# Altium schematic sheet Schematic.SchDoc
size A3; SheetNumber: 1; SheetTotal: 1
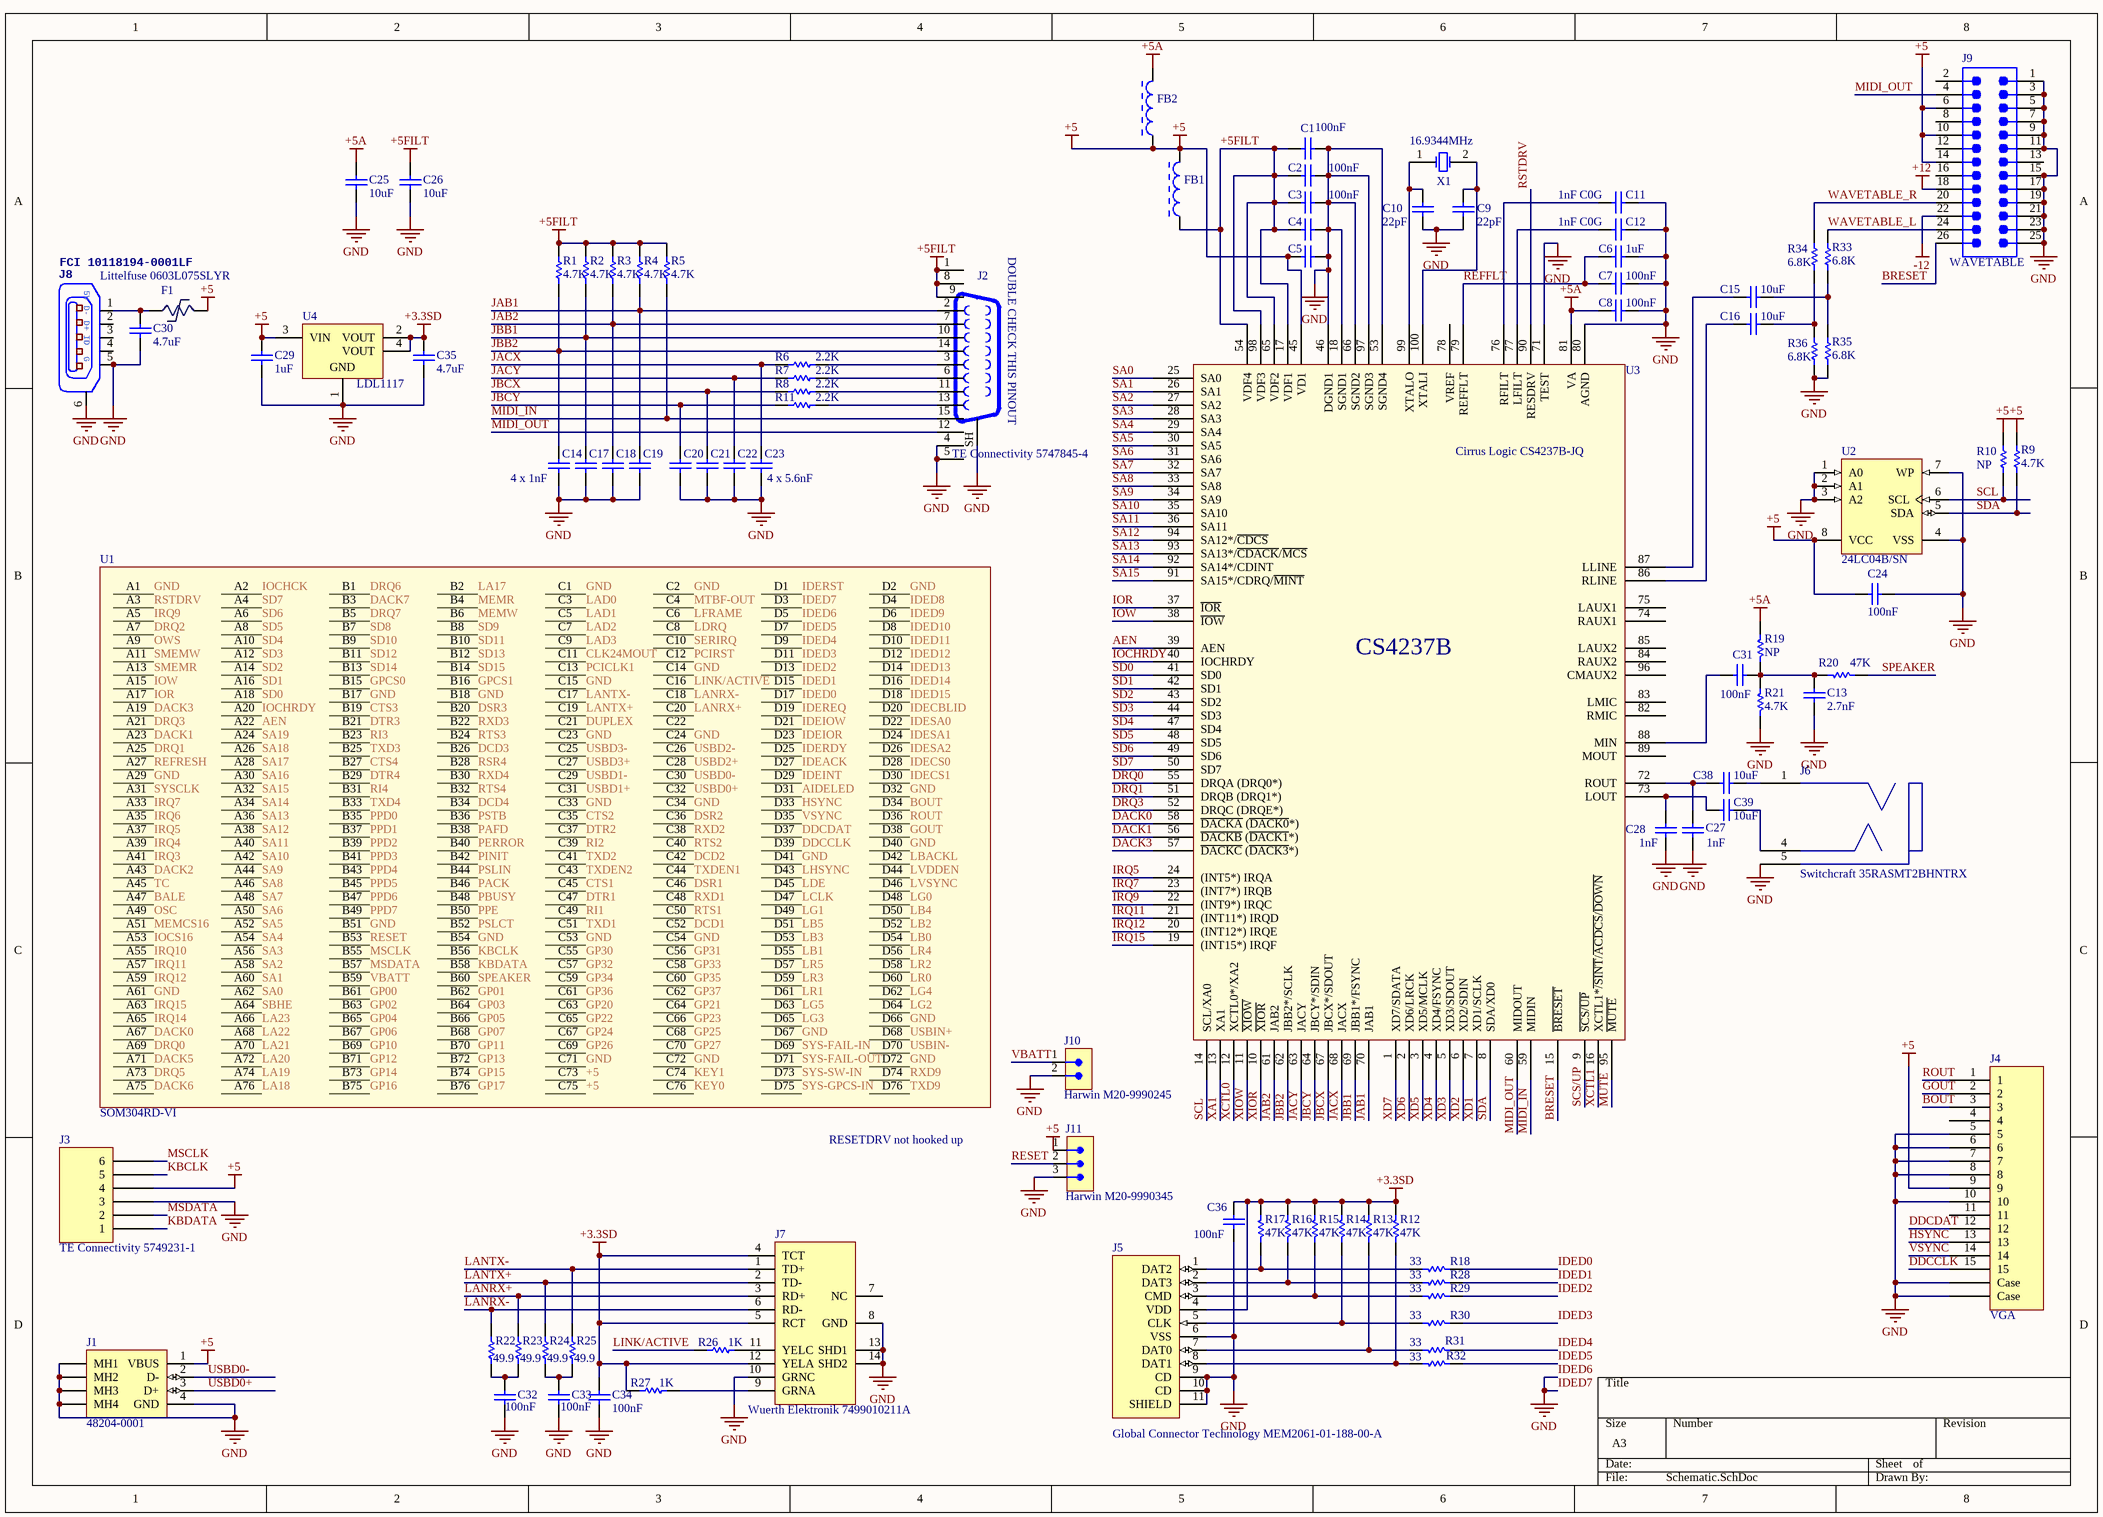
[diagram p0: Schematic.SchDoc]

## Parts
C1  100nF  [CAPC1608X90X35NL15T15]
C2  100nF  [CAPC1608X90X35NL15T15]
C3  100nF  [CAPC1608X90X35NL15T15]
C4  100nF  [CAPC1608X90X35NL15T15]  (value not drawn)
C5  100nF  [CAPC1608X90X35NL15T15]  (value not drawn)
C6  1uF  [CAPC3216X94X50NL20T25]
C7  100nF  [CAPC3216X94X50NL20T25]
C8  100nF  [CAPC3216X94X50NL20T25]
C9  22pF  [CAPC1608X90X40NL10T20]
C10  22pF  [CAPC1608X90X40NL10T20]
C11  1nF C0G  [CAPC3216X88X50NL20T25]
C12  1nF C0G  [CAPC3216X88X50NL20T25]
C13  2.7nF  [CAPC3216X127X50NL20T25]
C14  1nF  [CAPC1608X90X35NL15T15]  (value not drawn)
C15  10uF  [CAPC3216X180X55NL20T25]
C16  10uF  [CAPC3216X180X55NL20T25]
C17  1nF  [CAPC1608X90X35NL15T15]  (value not drawn)
C18  1nF  [CAPC1608X90X35NL15T15]  (value not drawn)
C19  1nF  [CAPC1608X90X35NL15T15]  (value not drawn)
C20  5.6nF  [CAPC1608X90X35NL15T15]  (value not drawn)
C21  5.6nF  [CAPC1608X90X35NL15T15]  (value not drawn)
C22  5.6nF  [CAPC1608X90X35NL15T15]  (value not drawn)
C23  5.6nF  [CAPC1608X90X35NL15T15]  (value not drawn)
C24  100nF  [CAPC3216X94X50NL20T25]
C25  10uF  [CAPC3216X178X50NL20T25]
C26  10uF  [CAPC3216X178X50NL20T25]
C27  1nF  [CAPC3216X88X50NL20T25]
C28  1nF  [CAPC3216X88X50NL20T25]
C29  1uF  [CAPC3216X94X50NL20T25]
C30  4.7uF  [CAPC3216X180X55NL20T25]
C31  100nF  [CAPC3216X94X50NL20T25]
C32  100nF  [CAPC3216X94X50NL20T25]
C33  100nF  [CAPC3216X94X50NL20T25]
C34  100nF  [CAPC3216X94X50NL20T25]
C35  4.7uF  [CAPC3216X180X55NL20T25]
C36  100nF  [CAPC1608X90X35NL15T15]
C38  10uF  [CAPC3216X180X55NL20T25]
C39  10uF  [CAPC3216X180X55NL20T25]
F1  Littelfuse 0603L075SLYR  [CAPC1608X90X35LL15T15]
FB1  BLM31PG601SN1L  [MURA-BLM31-B-CHIP-2_V]  (value not drawn)
FB2  BLM31PG601SN1L  [MURA-BLM31-B-CHIP-2_V]  (value not drawn)
J1  48204-0001  [MOLX-48204-0001_V]
J2  TE Connectivity 5747845-4  [PCBComponent_1]
J3  TE Connectivity 5749231-1  [PCB-8pubcbuq08v906tmuwpg-1]
J4  VGA  [PCB-x0gh5pgxbmovcv4siwv9-1]
J5  Global Connector Technology MEM2061-01-188-00-A  [PCB-vj52jxlahwjrb9vj8g9o-1]
J6  Switchcraft 35RASMT2BHNTRX  [PCB-329482-1]
J7  Wuerth Elektronik 7499010211A  [RJ45-7499010211A]
J8  FCI 10118194-0001LF  [USB 2.0 Micro B]
J9  WAVETABLE  [SMTC-TSW-113-08-X-D]
J10  Harwin M20-9990245  [PCB-exg861sgm8y1qikelj7a-1]
J11  Harwin M20-9990345  [PCB-sk86k7dvvjlolx5r1p4b-1]
R1  4.7K  [RESC1609X55X30NL10T20]
R2  4.7K  [RESC1609X55X30NL10T20]
R3  4.7K  [RESC1609X55X30NL10T20]
R4  4.7K  [RESC1609X55X30NL10T20]
R5  4.7K  [RESC1609X55X30NL10T20]
R6  2.2K  [RESC1608X55X30NL15T15]
R7  2.2K  [RESC1608X55X30NL15T15]
R8  2.2K  [RESC1608X55X30NL15T15]
R9  4.7K  [RESC3216X60X45NL10T20]
R10  NP  [RESC3216X60X45NL10T20]
R11  2.2K  [RESC1608X55X30NL15T15]
R12  47K  [RESC1608X55X30NL15T15]
R13  47K  [RESC1608X55X30NL15T15]
R14  47K  [RESC1608X55X30NL15T15]
R15  47K  [RESC1608X55X30NL15T15]
R16  47K  [RESC1608X55X30NL15T15]
R17  47K  [RESC1608X55X30NL15T15]
R18  33  [RESC1608X55X30NL15T15]
R19  NP  [RESC3216X65X50NL15T25]
R20  47K  [RESC3216X70X50NL20T25]
R21  4.7K  [RESC3216X65X50NL15T25]
R22  49.9  [RESC3216X70X50NL20T25]
R23  49.9  [RESC3216X70X50NL20T25]
R24  49.9  [RESC3216X70X50NL20T25]
R25  49.9  [RESC3216X70X50NL20T25]
R26  1K  [RESC3216X70X50NL20T25]
R27  1K  [RESC3216X70X50NL20T25]
R28  33  [RESC1608X55X30NL15T15]
R29  33  [RESC1608X55X30NL15T15]
R30  33  [RESC1608X55X30NL15T15]
R31  33  [RESC1608X55X30NL15T15]
R32  33  [RESC1608X55X30NL15T15]
R33  6.8K  [RESC3216X60X45NL10T20]
R34  6.8K  [RESC3216X60X45NL10T20]
R35  6.8K  [RESC3216X60X45NL10T20]
R36  6.8K  [RESC3216X60X45NL10T20]
U1  SOM304RD-VI  [Quad20]
U2  24LC04B/SN  [SOIC-SN8_N]
U3  Cirrus Logic CS4237B-JQ  [PCBComponent_1]
U4  LDL1117  [PCB-elchkyvpbzx92dsq0s9t-1]
X1  16.9344MHz  [PCB-fu593xkg4al34p0f0gbr-1]

## Nets
+3.3SD: C34.2 C35.2 C36.1 J5.4(VDD) J7.4(TCT) J7.5(RCT) J7.12(YELA) R12.2 R13.2 R14.2 R15.2 R16.2 R17.2 R27.1 U4.2(VOUT) U4.4(VOUT)
+5: C5.1 C24.1 C29.2 F1.2 FB1.2 FB2.1 J1.1(VBUS) J3.4 J4.9 J9.6 J9.10 J9.14 J11.1 R9.2 R10.2 U1.C73 U1.C75 U2.8(VCC) U3.45(VD1) U4.3(VIN)
+5A: C8.1 C25.2 FB2.2 R19.2 U3.81(VA)
+5FILT: C1.1 C2.1 C3.1 C4.1 C26.2 FB1.1 J2.1 J2.8 R1.2 R2.2 R3.2 R4.2 R5.2 U3.17(VDF1) U3.54(VDF4) U3.65(VDF2) U3.98(VDF3)
+12: J9.18
-12: J9.22
GND: C1.2 C2.2 C3.2 C4.2 C5.2 C6.2 C7.2 C8.2 C9.1 C10.1 C11.2 C12.2 C13.2 C14.1 C17.1 C18.1 C19.1 C20.1 C21.1 C22.1 C23.1 C24.2 C25.1 C26.1 C27.2 C28.2 C29.1 C30.1 C32.1 C33.1 C34.1 C35.1 C36.2 J1.4(GND) J1.MH1 J1.MH2 J1.MH3 J1.MH4 J2.4 J2.5 J2.SH J3.3 J4.5 J4.6 J4.7 J4.8 J4.10 J4.SH1(Case) J4.SH2(Case) J5.6(VSS) J5.9(CD) J5.10(CD) J5.11(SHIELD) J6.5 J7.8(GND) J7.10(GRNC) J7.13(SHD1) J7.14(SHD2) J8.5 J8.6 J9.1 J9.3 J9.5 J9.7 J9.9 J9.11 J9.15 J9.17 J9.19 J9.21 J9.23 J9.25 J10.2 J11.3 R21.1 R35.1 R36.1 U1.A1 U1.A29 U1.A61 U1.B17 U1.B18 U1.B51 U1.B54 U1.C1 U1.C2 U1.C14 U1.C15 U1.C23 U1.C24 U1.C33 U1.C34 U1.C53 U1.C54 U1.C71 U1.C72 U1.D2 U1.D3 U1.D5 U1.D32 U1.D40 U1.D41 U1.D66 U1.D67 U1.D72 U2.1(A0) U2.2(A1) U2.3(A2) U2.4(VSS) U2.7(WP) U3.18(SGND1) U3.46(DGND1) U3.53(SGND4) U3.66(SGND2) U3.71(TEST) U3.80(AGND) U3.97(SGND3) U4.1(GND)  [also labelled IDED6, IDED7]
AEN: U1.A22 U3.39(AEN)
AIDELED: U1.D31
BALE: U1.A47
BOUT: J4.3 U1.D34
BRESET: J9.26 U3.15(~{BRESET})
CLK24MOUT: U1.C11
CTS1: U1.C45
CTS2: U1.C35
CTS3: U1.B19
CTS4: U1.B27
DACK0: U1.A67 U3.58(~{DACKA}_(~{DACK0}*))
DACK1: U1.A23 U3.56(~{DACKB}_(~{DACK1}*))
DACK2: U1.A43
DACK3: U1.A19 U3.57(~{DACKC}_(~{DACK3}*))
DACK5: U1.A71
DACK6: U1.A75
DACK7: U1.B3
DCD1: U1.C52
DCD2: U1.C42
DCD3: U1.B26
DCD4: U1.B34
DDCCLK: J4.15 U1.D39
DDCDAT: J4.12 U1.D37
DRQ0: U1.A69 U3.55(DRQA_(DRQ0*))
DRQ1: U1.A25 U3.51(DRQB_(DRQ1*))
DRQ2: U1.A7
DRQ3: U1.A21 U3.52(DRQC_(DRQE*))
DRQ5: U1.A73
DRQ6: U1.B1
DRQ7: U1.B5
DSR1: U1.C46
DSR2: U1.C36
DSR3: U1.B20
DTR1: U1.C47
DTR2: U1.C37
DTR3: U1.B21
DTR4: U1.B29
DUPLEX: U1.C21
GOUT: J4.2 U1.D38
GP00: U1.B61
GP01: U1.B62
GP02: U1.B63
GP03: U1.B64
GP04: U1.B65
GP05: U1.B66
GP06: U1.B67
GP07: U1.B68
GP10: U1.B69
GP11: U1.B70
GP12: U1.B71
GP13: U1.B72
GP14: U1.B73
GP15: U1.B74
GP16: U1.B75
GP17: U1.B76
GP20: U1.C63
GP21: U1.C64
GP22: U1.C65
GP23: U1.C66
GP24: U1.C67
GP25: U1.C68
GP26: U1.C69
GP27: U1.C70
GP30: U1.C55
GP31: U1.C56
GP32: U1.C57
GP33: U1.C58
GP34: U1.C59
GP35: U1.C60
GP36: U1.C61
GP37: U1.C62
GPCS0: U1.B15
GPCS1: U1.B16
HSYNC: J4.13 U1.D33
IDEACK: U1.D27
IDECBLID: U1.D20
IDECS0: U1.D28
IDECS1: U1.D30
IDED0: R18.1 U1.D17
IDED1: R28.1 U1.D15
IDED2: R29.1 U1.D13
IDED3: R30.1 U1.D11
IDED4: R31.1 U1.D9
IDED5: R32.1 U1.D7
IDED8: U1.D4
IDED9: U1.D6
IDED10: U1.D8
IDED11: U1.D10
IDED12: U1.D12
IDED13: U1.D14
IDED14: U1.D16
IDED15: U1.D18
IDEINT: U1.D29
IDEIOR: U1.D23
IDEIOW: U1.D21
IDERDY: U1.D25
IDEREQ: U1.D19
IDERST: U1.D1
IDESA0: U1.D22
IDESA1: U1.D24
IDESA2: U1.D26
IOCHCK: U1.A2
IOCHRDY: U1.A20 U3.40(IOCHRDY)
IOCS16: U1.A53
IOR: U1.A17 U3.37(~{IOR})
IOW: U1.A15 U3.38(~{IOW})
IRQ3: U1.A41
IRQ4: U1.A39
IRQ5: U1.A37 U3.24((INT5*)_IRQA)
IRQ6: U1.A35
IRQ7: U1.A33 U3.23((INT7*)_IRQB)
IRQ9: U1.A5 U3.22((INT9*)_IRQC)
IRQ10: U1.A55
IRQ11: U1.A57 U3.21((INT11*)_IRQD)
IRQ12: U1.A59 U3.20((INT12*)_IRQE)
IRQ14: U1.A65
IRQ15: U1.A63 U3.19((INT15*)_IRQF)
JAB1: C19.2 J2.2 R4.1 U3.70(JAB1)
JAB2: C18.2 J2.7 R3.1 U3.61(JAB2)
JACX: C23.2 R6.1 U3.68(JACX)
JACY: C22.2 R7.1 U3.63(JACY)
JBB1: C17.2 J2.10 R2.1 U3.69(JBB1*/FSYNC)
JBB2: C14.2 J2.14 R1.1 U3.62(JBB2*/SCLK)
JBCX: C21.2 R8.1 U3.67(JBCX*/SDOUT)
JBCY: C20.2 R11.1 U3.64(JBCY*/SDIN)
KBCLK: J3.5 U1.B56
KBDATA: J3.1 U1.B58
KEY0: U1.C76
KEY1: U1.C74
LA17: U1.B2
LA18: U1.A76
LA19: U1.A74
LA20: U1.A72
LA21: U1.A70
LA22: U1.A68
LA23: U1.A66
LAD0: U1.C3
LAD1: U1.C5
LAD2: U1.C7
LAD3: U1.C9
LANRX+: J7.3(RD+) R23.2 U1.C20
LANRX-: J7.6(RD-) R22.2 U1.C18
LANTX+: J7.2(TD-) R24.2 U1.C19
LANTX-: J7.1(TD+) R25.2 U1.C17
LB0: U1.D54
LB1: U1.D55
LB2: U1.D52
LB3: U1.D53
LB4: U1.D50
LB5: U1.D51
LBACKL: U1.D42
LCLK: U1.D47
LDE: U1.D45
LDRQ: U1.C8
LFRAME: U1.C6
LG0: U1.D48
LG1: U1.D49
LG2: U1.D64
LG3: U1.D65
LG4: U1.D62
LG5: U1.D63
LHSYNC: U1.D43
LINK/ACTIVE: R26.1 U1.C16
LR0: U1.D60
LR1: U1.D61
LR2: U1.D58
LR3: U1.D59
LR4: U1.D56
LR5: U1.D57
LVDDEN: U1.D44
LVSYNC: U1.D46
MEMCS16: U1.A51
MEMR: U1.B4
MEMW: U1.B6
MIDI_IN: J2.15 R5.1 U3.59(MIDIN)
MIDI_OUT: J2.12 J9.4 U3.60(MIDOUT)
MSCLK: J3.6 U1.B55
MSDATA: J3.2 U1.B57
MTBF-OUT: U1.C4
MUTE: U3.95(~{MUTE})
OSC: U1.A49
OWS: U1.A9
PACK: U1.B46
PAFD: U1.B38
PBUSY: U1.B48
PCICLK1: U1.C13
PCIRST: U1.C12
PERROR: U1.B40
PINIT: U1.B42
PPD0: U1.B35
PPD1: U1.B37
PPD2: U1.B39
PPD3: U1.B41
PPD4: U1.B43
PPD5: U1.B45
PPD6: U1.B47
PPD7: U1.B49
PPE: U1.B50
PSLCT: U1.B52
PSLIN: U1.B44
PSTB: U1.B36
REFFLT: C6.1 C7.1 U3.79(REFFLT)
REFRESH: U1.A27
RESET: J11.2 U1.B53
RI1: U1.C49
RI2: U1.C39
RI3: U1.B23
RI4: U1.B31
ROUT: J4.1 U1.D36
RSR4: U1.B28
RSTDRV: U1.A3 U3.90(RESDRV)
RTS1: U1.C50
RTS2: U1.C40
RTS3: U1.B24
RTS4: U1.B32
RXD1: U1.C48
RXD2: U1.C38
RXD3: U1.B22
RXD4: U1.B30
RXD9: U1.D74
SA0: U1.A62 U3.25(SA0)
SA1: U1.A60 U3.26(SA1)
SA2: U1.A58 U3.27(SA2)
SA3: U1.A56 U3.28(SA3)
SA4: U1.A54 U3.29(SA4)
SA5: U1.A52 U3.30(SA5)
SA6: U1.A50 U3.31(SA6)
SA7: U1.A48 U3.32(SA7)
SA8: U1.A46 U3.33(SA8)
SA9: U1.A44 U3.34(SA9)
SA10: U1.A42 U3.35(SA10)
SA11: U1.A40 U3.36(SA11)
SA12: U1.A38 U3.94(SA12*/~{CDCS})
SA13: U1.A36 U3.93(SA13*/~{CDACK}/~{MCS})
SA14: U1.A34 U3.92(SA14*/CDINT)
SA15: U1.A32 U3.91(SA15*/CDRQ/~{MINT})
SA16: U1.A30
SA17: U1.A28
SA18: U1.A26
SA19: U1.A24
SBHE: U1.A64
SCL: R10.1 U2.6(SCL) U3.14(SCL/XA0)
SCS/UP: U3.9(~{SCS/UP})
SD0: U1.A18 U3.41(SD0)
SD1: U1.A16 U3.42(SD1)
SD2: U1.A14 U3.43(SD2)
SD3: U1.A12 U3.44(SD3)
SD4: U1.A10 U3.47(SD4)
SD5: U1.A8 U3.48(SD5)
SD6: U1.A6 U3.49(SD6)
SD7: U1.A4 U3.50(SD7)
SD8: U1.B7
SD9: U1.B8
SD10: U1.B9
SD11: U1.B10
SD12: U1.B11
SD13: U1.B12
SD14: U1.B13
SD15: U1.B14
SDA: R9.1 U2.5(SDA) U3.8(SDA/XD0)
SERIRQ: U1.C10
SMEMR: U1.A13
SMEMW: U1.A11
SPEAKER: R20.1 U1.B60
SYS-FAIL-IN: U1.D69
SYS-FAIL-OUT: U1.D71
SYS-GPCS-IN: U1.D75
SYS-SW-IN: U1.D73
SYSCLK: U1.A31
TC: U1.A45
TXD1: U1.C51
TXD2: U1.C41
TXD3: U1.B25
TXD4: U1.B33
TXD9: U1.D76
TXDEN1: U1.C44
TXDEN2: U1.C43
USBD0+: J1.3(D+) U1.C32
USBD0-: J1.2(D-) U1.C30
USBD1+: U1.C31
USBD1-: U1.C29
USBD2+: U1.C28
USBD2-: U1.C26
USBD3+: U1.C27
USBD3-: U1.C25
USBIN+: U1.D68
USBIN-: U1.D70
VBATT: J10.1 U1.B59
VSYNC: J4.14 U1.D35
WAVETABLE_L: J9.24 R33.2
WAVETABLE_R: J9.20 R34.2
XA1: U3.13(XA1)
XCTL0: U3.12(XCTL0*/XA2)
XCTL1: U3.16(XCTL1*~{/SINT}/~{ACDCS}/~{DOWN})
XD1: U3.7(XD1/SCLK)
XD2: U3.6(XD2/SDIN)
XD3: U3.5(XD3/SDOUT)
XD4: U3.4(XD4/FSYNC)
XD5: U3.3(XD5/MCLK)
XD6: U3.2(XD6/LRCK)
XD7: U3.1(XD7/SDATA)
XIOR: U3.10(~{XIOR})
XIOW: U3.11(~{XIOW})
NetC9_2: C9.2 U3.100(XTALI) X1.2(X2)
NetC10_2: C10.2 U3.99(XTALO) X1.1(X1)
NetC11_1: C11.1 U3.76(RFILT)
NetC12_1: C12.1 U3.77(LFILT)
NetC13_1: C13.1 C31.1 R19.1 R20.2 R21.2
NetC15_1: C15.1 U3.87(LLINE)
NetC15_2: C15.2 R33.1 R35.2
NetC16_1: C16.1 U3.86(RLINE)
NetC16_2: C16.2 R34.1 R36.2
NetC27_1: C27.1 C38.1 U3.72(ROUT)
NetC28_1: C28.1 C39.1 U3.73(LOUT)
NetC30_2: C30.2 F1.1 J8.1
NetC31_2: C31.2 U3.88(MIN)
NetC32_2: C32.2 R22.1 R23.1
NetC33_2: C33.2 R24.1 R25.1
NetC38_2: C38.2 J6.1
NetC39_2: C39.2 J6.4
NetJ2_3: J2.3 R6.2
NetJ2_6: J2.6 R7.2
NetJ2_11: J2.11 R8.2
NetJ2_13: J2.13 R11.2
NetJ5_1: J5.1(DAT2) R17.1 R18.2
NetJ5_2: J5.2(DAT3) R16.1 R28.2
NetJ5_3: J5.3(CMD) R15.1 R29.2
NetJ5_5: J5.5(CLK) R14.1 R30.2
NetJ5_7: J5.7(DAT0) R13.1 R31.2
NetJ5_8: J5.8(DAT1) R12.1 R32.2
NetJ7_9: J7.9(GRNA) R27.2
NetJ7_11: J7.11(YELC) R26.2

Not connected (* = marked no-connect by the designer): J2 9; J4 4 11; J7 7(NC); J8 2 3 4; J9 2 8 12 13 16; U1 C22; U3 74(RAUX1) 75(LAUX1) 78(VREF) 82(RMIC) 83(LMIC) 84(RAUX2) 85(LAUX2) 89(MOUT) 96(CMAUX2)

## Notes on the sheet
- (near J2) DOUBLE CHECK THIS PINOUT
- (near C14) 4 x 1nF
- (near C23) 4 x 5.6nF
- (near U1) RESETDRV not hooked up
- (in symbol CMP-86f04ebedf8a5937-54) 5V; D-; D+; ID; G
- (in symbol CMP-3342fa36a86cec85-5) CS4237B

## Library data of the parts
C1-C5 C36 = CMP-126799-2: CAP CER 0.1UF 50V 10% X7R 0603; Manufacturer Part Number: 06035C104K4T2A; Capacitance: 1e-07 F; Dielectric Material: Ceramic Multilayer; Lead-Free Status: Lead Free; Voltage Rating (DC): 50.0 V; Capacitance Tolerance: ±10%; Case/Package: 0603; Dielectric Characteristic: X7R; Mounting Style: Surface Mount; Number of Pins: 2; Octopart Url: https://octopart.com/06035c104k4t2a-avx+interconnect+%2F+elco-2665160; OctopartID: 492d800fc68396ea; Packaging: Cut Tape (CT); REACH SVHC Compliance: No SVHC; RoHS: Compliant
C6-C8 C24 C29 C31-C34 = CMP-126010-2: CAP CER 0.1UF 50V 10% X7R 1206; Manufacturer Part Number: 12065C104KAT2A; Capacitance: 1e-07 F; Case/Package (SI): 3216; Dielectric Material: Ceramic; Insulation Resistance: 1e+11 Ω; Lead-Free Status: Lead Free; Voltage Rating (DC): 50.0 V; Capacitance Tolerance: ±10%; Case/Package: 1206; Dielectric Characteristic: X7R; Mounting Style: Surface Mount; Number of Pins: 2; Octopart Url: https://octopart.com/12065c104kat2a-avx+interconnect+%2F+elco-39590617; OctopartID: 839348c5bc2c5c54; REACH SVHC Compliance: No SVHC; RoHS: Compliant; Size-Height: 0.00094 m; Size-Length: 0.0032004 m; Size-Thickness: 0.0009398 m; Size-Width: 0.0016002 m
C9 C10 = CMP-123797-2: CAP CER 22PF 50V 5% NPO 0603; Manufacturer Part Number: CC0603JRNPO9BN220; Capacitance: 2.2e-11 F; Dielectric Characteristic: C0G/NP0; Dielectric Material: Ceramic Multilayer; Insulation Resistance: 1e+11 Ω; Lead-Free Status: Lead Free; Voltage Rating (DC): 50.0 V; Capacitance Tolerance: ±5%; Case/Package: 0603; Halogen Free Status: Halogen Free; Mounting Style: Surface Mount; Number of Pins: 2; Octopart Url: https://octopart.com/cc0603jrnpo9bn220-yageo-192915; OctopartID: a4606d6870957ba7; REACH SVHC Compliance: No SVHC; RoHS: Compliant
C11 C12 C27 C28 = CMP-8261919-2: Multilayer Ceramic Capacitors MLCC - SMD/SMT 50volts 1000pF 10% X7R; Manufacturer Part Number: C1206C102K5RAC; Capacitance: 1e-09 F; Case/Package (SI): 3216; Lead-Free Status: R; Voltage Rating (DC): 50.0 V; Capacitance Tolerance: ±10%; Case/Package: 1206; Dielectric Characteristic: X7R; Dielectric Material: Ceramic; Mounting Style: Surface Mount; Number of Pins: 2; Octopart Url: https://octopart.com/c1206c102k5rac-kemet-967170; OctopartID: 80a249a667c65f65; RoHS: Compliant
C13 = CMP-187473-2: CAP CER 2700PF 50V 1% NP0 1206; Manufacturer Part Number: 12065A272FAT2A; Capacitance: 2.7e-09 F; Case/Package (SI): 3216; Dielectric Characteristic: C0G/NP0; Voltage Rating (DC): 50.0 V; Capacitance Tolerance: ±1%; Case/Package: 1206; Octopart Url: https://octopart.com/12065a272fat2a-avx+interconnect+%2F+elco-9080302; OctopartID: 52379bb7fabf8df0; Packaging: Tape; RoHS: Compliant
C14 C17-C19 = CMP-16486501-2: Manufacturer Part Number: 06035C102KAT2A; Capacitance: 1e-09 F; Capacitance Tolerance: ±10%; Dielectric Characteristic: X7R; Dielectric Material: Ceramic; Lead-Free Status: Lead Free; Voltage Rating (DC): 50.0 V; Case/Package: 0603; Mounting Style: Surface Mount; Number of Pins: 2; Octopart Url: https://octopart.com/06035c102kat2a-avx+interconnect+%2F+elco-39513096; OctopartID: 84774f274d195bb0; REACH SVHC Compliance: No SVHC; RoHS: Compliant; Size-Height: 0.00086 m; Size-Length: 0.0016 m; Size-Width: 0.00081 m
C15 C16 C38 C39 = CMP-19299751-2: CAP CER 10UF 25V 10% X5R 1206; Manufacturer Part Number: GRM31CR61E106KA12L; Capacitance: 1e-05 F; Case/Package (SI): 3216; Lead-Free Status: Lead Free; Voltage Rating (DC): 25.0 V; Capacitance Tolerance: ±10%; Dielectric Characteristic: X5R; Lifecycle Status: Active; Mounting Style: Surface Mount; Number of Pins: 2; Octopart Url: https://octopart.com/grm31cr61e106ka12l-murata-196991; OctopartID: fab233bbdeab2575; REACH SVHC Compliance: No SVHC; RoHS: Compliant; Size-Height: 0.0016 m; Size-Length: 0.0032 m; Size-Thickness: 0.0016 m; Size-Width: 0.0016 m
C20-C23 = CMP-126265-2: CAP CER 5600PF 100V 10% X7R 0603; Manufacturer Part Number: 06031C562KAT2A; Capacitance: 5.6e-09 F; Lead-Free Status: Lead Free; Voltage Rating (DC): 100.0 V; Capacitance Tolerance: ±10%; Case/Package: 0603; Dielectric Characteristic: X7R; Number of Pins: 2; Octopart Url: https://octopart.com/06031c562kat2a-avx+interconnect+%2F+elco-7842954; OctopartID: f6d03fad7f3c2917; Packaging: Cut Tape (CT); RoHS: Compliant
C25 C26 = CMP-127283-2: CAP CER 10UF 16V 10% X7R 1206; Manufacturer Part Number: 1206YC106KAT2A; Capacitance: 1e-05 F; Dielectric Material: Ceramic Multilayer; Lead-Free Status: Lead Free; Voltage Rating (DC): 16.0 V; Capacitance Tolerance: ±10%; Case/Package: 1206; Dielectric Characteristic: X7R; Mounting Style: Surface Mount; Number of Pins: 2; Octopart Url: https://octopart.com/1206yc106kat2a-avx+interconnect+%2F+elco-42270891; OctopartID: f5623eedd0af2aa5; REACH SVHC Compliance: No SVHC; RoHS: Compliant
C30 C35 = CMP-121870-2: CAP CER 4.7UF 25V 10% X7R 1206; Manufacturer Part Number: GCM31CR71E475KA55L; Capacitance: 4.7e-06 F; Lead-Free Status: Lead Free; Voltage Rating (DC): 25.0 V; Capacitance Tolerance: ±10%; Case/Package: 1206; Dielectric Characteristic: X7R; Octopart Url: https://octopart.com/gcm31cr71e475ka55l-murata-12602764; OctopartID: 3b83f2495369e444; RoHS: Compliant
F1 = CMP-b6bb7ec626f8697c-2: PTC Resettable Fuse 0.75A(hold) 1.5A(trip) 6VDC 50A 0.6W 0.2s 0.005Ohm SMD Solder Pad 0603 T/R; OctopartID: b6bb7ec626f8697c
FB1 FB2 = CMP-886796-3: Chip Ferrite Bead for Power Lines, 600 Ohm, 1500 mA, -55 to 125 degC, 3.2 x 1.6 x 1.3 mm SMD, Tape and Reel; Case/Package (SI): 3216; Current Rating: 1.5 A; Frequency: 100000000.0 Hz; Lead-Free Status: Lead Free; Shielding: No; Case/Package: 1206; Mounting Style: Surface Mount; Octopart Url: https://octopart.com/blm31pg601sn1l-murata-40240; OctopartID: 645fad55dc09bb98; RoHS: Compliant; Size-Height: 0.0011 m; Size-Length: 0.0032 m; Size-Width: 0.0016 m; Manufacturer Part Number: BLM31PG601SN1L
J1 = CMP-778514-3: USB Shielded I/O Receptacle, Type A; Number of Circuits: 4; Gender: Female; Current Rating: 1.0 A; Contact Material: Phosphor Bronze; Halogen Free Status: Not Low Halogen; Orientation: Vertical; REACH SVHC Compliance: No SVHC; Octopart Url: https://octopart.com/48204-0001-molex+%2F+waldom-59165870; Lifecycle Status: Active; Contact Plating: Gold; Manufacturer Part Number: 48204-0001; OctopartID: 078fcef1f108d848; RoHS: Compliant; Number of Contacts: 4; Number of Rows: 3
J2 = CMP-30ddfb12a784ef1a-2: Conn D-Subminiature SKT 15 POS 2.74mm Solder RA Thru-Hole 15 Terminal 1 Port Box; Number of Contacts: 15; Lead-Free Status: Lead Free; Insulation Resistance: 1.00 GΩ (min); ELV Compliant: Compliant; Octopart URL: https://octopart.com/5747845-4-te+connectivity-46510655; Size-Width: 18.8 mm; Manufacturer: TE Connectivity; Manufacturer Part Number: 5747845-4; Material: Steel; Color: Black; Lifecycle Status: Active; RoHS: Compliant; Housing Color: Black; Number of Rows: 2; Number of Positions: 15; OctopartID: 30ddfb12a784ef1a; Contact Plating: Tin, Gold, Tin over Nickel; Packaging: Box; Contact Material: Phosphor Bronze
J3 = CMP-b8aa73653b4d676d-4: Conn Miniature Circular DIN RCP 6 POS Solder RA Thru-Hole 6 Terminal 1 Port Tube; Number of Contacts: 6; Gender: Female; Lead-Free Status: Lead Free; Current Rating: 1.0 A; ELV Compliant: Compliant; Shielding: Yes; Flammability Rating: UL 94 V-0; Manufacturer Part Number: 5749231-1; Lifecycle Status: Active; Contact Material: Copper Alloy; OctopartID: b8aa73653b4d676d; RoHS: Compliant; Contact Plating: Tin, Gold Flash; Packaging: Tube; Color: Black; Mounting Style: Through Hole; Orientation: Right Angle; Housing Material: Thermoplastic; Housing Color: Black; Octopart URL: http://octopart.com/5749231-1-te+connectivity-46507649; Number of Positions: 6; REACH SVHC Compliance: No SVHC
J4 = CMP-7c98b7f9b7f9a35f-8: Conn High Density D-Sub SKT 15 POS 2.28mm Solder RA Thru-Hole 15 Terminal 1 Port
J5 = CMP-7becb6d27978a42b-3: MEM2061 Series 8 Position 1.1 mm Pitch Push-Push MicroSD SMT Memory Card Connector
J6 = CMP-329482-6: CONN JACK MONO 3.5MM SMD; Lead-Free Status: Lead Free; RoHS: Compliant; OctopartID: 3284fb872060ed43; Manufacturer Part Number: 35RASMT2BHNTRX; Octopart Url: https://octopart.com/35rasmt2bhntrx-switchcraft-604034
J7 = CMP-3fddf76d6392e01a-1: Integrated RJ45 Transformer WE-RJ45LAN; Number of Contacts: 8; Gender: Male; Contact Plating: Gold; Seller Landing  Url: https://octopart-clicks.com/click/track?country=US&ak=8157f166&sig=08cc4a3&sid=2402&ppid=28997929&vpid=96900031&ct=offers; REACH SVHC Compliance: No SVHC; Mounting Style: Through Hole; OctopartID: 3fddf76d6392e01a; RoHS: Compliant; Octopart Url: http://octopart.com/7499010211a-w%C3%BCrth+elektronik-28997929; Manufacturer Part Number: 7499010211A
J8 = CMP-86f04ebedf8a5937-54: Single Port 5 Contact Horizontal Right Angle Micro B USB 2.0 Receptacle
J9 = CMP-3824068-2: 0.025" SQ Post Header, Through-hole, Vertical, -55 to 125 degC, 2.54 mm Pitch, 26-Pin, Male, RoHS; Manufacturer Part Number: TSW-113-08-G-D; Lead-Free Status: Lead Free; Number of Contacts: 26; Pin Pitch: 0.00254 m; Contact Material: Phosphor Bronze; Contact Plating: Gold; Gender: Male; Housing Color: Black; Housing Material: Plastic; Mounting Style: Through Hole; Number of Positions: 26; Number of Rows: 2; Octopart Url: https://octopart.com/tsw-113-08-g-d-samtec-272558; OctopartID: d5c81cc6d8000a0f; REACH SVHC Compliance: No SVHC; RoHS: Compliant; Size-Height: 0.00254 m; Size-Length: 0.03302 m; Size-Width: 0.00508 m
J10 = CMP-2482229-32: Board-To-Board Connector, M20 Series, Through Hole, Header, 2, 2.54 mm, Gold Plated Contacts; Contact Resistance: 25.0 mΩ; Number of Mating Cycles: 300; Number of Contacts: 2; Gender: Male; Pin Pitch: 2.54 mm; Voltage Rating (AC): 750 V; Insulation Resistance: 10.0 GΩ; Current Rating: 3.00 A; Manufacturer Part Number: M20-9990245; Operating Temperature: -40.0 °C (min); OctopartID: 13d0daa8641bcc17; Octopart URL: https://octopart.com/m20-9990245-harwin-7492269; RoHS: Compliant; Contact Plating: Gold; REACH SVHC Compliance: No SVHC; Mounting Style: Through Hole, Vertical; Contact Material: Phosphor Bronze
J11 = CMP-683aa16207d4b7fd-21: Board-To-Board Connector, M20 Series, Through Hole, Header, 3, 2.54 mm, Gold Plated Contacts; Insulation Resistance: 10.0 GΩ; Voltage Rating (AC): 750 V; Pin Pitch: 2.54 mm; Current Rating: 3.00 A; Contact Resistance: 25.0 mΩ; Gender: Male; Number of Contacts: 3; Number of Mating Cycles: 300; RoHS: Compliant; Contact Material: Phosphor Bronze; Mounting Style: Through Hole, Vertical; Octopart URL: https://octopart.com/m20-9990345-harwin-5393032; REACH SVHC Compliance: No SVHC; Operating Temperature: -40.0 °C (min); Contact Plating: Gold; Manufacturer Part Number: M20-9990345
R1-R5 = CMP-1863095-2: RES SMD 4.7K OHM 0.1% 1/10W 0603; Manufacturer Part Number: TNPW06034K70BEEA; Lead-Free Status: Lead Free; Power Rating: 0.1 W; Resistance: 4700.0 Ω; Voltage Rating (DC): 75.0 V; Case/Package: 0603; Number of Pins: 2; Octopart Url: https://octopart.com/tnpw06034k70beea-vishay+dale-42338354; OctopartID: 172ddca13a79c8ea; Packaging: Cut Tape (CT); Resistance Tolerance: ±0.1%; RoHS: Compliant
R6-R8 R11 = CMP-3652689-2: Thick Film Resistors - SMD 0603 2.2Kohms 5% Tol; Manufacturer Part Number: ERJ-3GEYJ222V; Lead-Free Status: Lead Free; Power Rating: 0.1 W; Resistance: 2200.0 Ω; Voltage Rating (DC): 75.0 V; Case/Package: 0603; Lifecycle Status: Not Listed by Manufacturer; Mounting Style: Surface Mount; Octopart Url: https://octopart.com/erj-3geyj222v-panasonic-55422038; OctopartID: 3907f340b037e6c0; Packaging: Cut Tape (CT); REACH SVHC Compliance: No SVHC; Resistance Tolerance: ±5%; RoHS: Compliant; Size-Height: 0.00045 m; Size-Length: 0.0016 m; Size-Width: 0.0008 m
R9 R10 R33-R36 = CMP-1867680-2: RES SMD 6.8K OHM 5% 1/4W 1206; Manufacturer Part Number: CRCW12066K80JNEA; Case/Package (SI): 3216; Lead-Free Status: Lead Free; Power Rating: 0.25 W; Resistance: 6800.0 Ω; Temperature Coefficient: 200.0 ppm/°C; Voltage Rating (DC): 200.0 V; Case/Package: 1206; Mounting Style: Surface Mount; Number of Pins: 2; Octopart Url: https://octopart.com/crcw12066k80jnea-vishay+dale-39455177; OctopartID: 4e2d857d628291ea; Packaging: Cut Tape (CT); Resistance Tolerance: ±5%; RoHS: Compliant; Size-Height: 0.00055 m; Size-Length: 0.0032 m; Size-Width: 0.0016 m
R12-R17 = CMP-3655150-2: Thick Film Resistors - SMD 0603 47Kohms 5% Tol; Manufacturer Part Number: ERJ-3GEYJ473V; Lead-Free Status: Lead Free; Power Rating: 0.1 W; Resistance: 47000.0 Ω; Voltage Rating (DC): 75.0 V; Case/Package: 0603; Lifecycle Status: Not Listed by Manufacturer; Mounting Style: Surface Mount; Octopart Url: https://octopart.com/erj-3geyj473v-panasonic-55422112; OctopartID: f66a3c2d7fac29ad; Packaging: Cut Tape (CT); REACH SVHC Compliance: No SVHC; Resistance Tolerance: ±5%; RoHS: Compliant; Size-Height: 0.00045 m; Size-Length: 0.0016 m; Size-Width: 0.0008 m
R18 R28-R32 = CMP-3655132-2: Thick Film Resistors - SMD 0603 33ohms 5% Tol; Manufacturer Part Number: ERJ-3GEYJ330V; Lead-Free Status: Lead Free; Power Rating: 0.1 W; Resistance: 33.0 Ω; Voltage Rating (DC): 75.0 V; Case/Package: 0603; Lifecycle Status: Not Listed by Manufacturer; Mounting Style: Surface Mount; Octopart Url: https://octopart.com/erj-3geyj330v-panasonic-55422078; OctopartID: c8d6029141ce1711; Packaging: Cut Tape (CT); REACH SVHC Compliance: No SVHC; Resistance Tolerance: ±5%; RoHS: Compliant; Size-Height: 0.00045 m; Size-Length: 0.0016 m; Size-Width: 0.0008 m
R19 R21 = CMP-1954429-2: RES SMD 4.7K OHM 0.1% 1/4W 1206; Manufacturer Part Number: TNPW12064K70BEEN; Lead-Free Status: Lead Free; Power Rating: 0.25 W; Resistance: 4700.0 Ω; Case/Package: 1206; Octopart Url: https://octopart.com/tnpw12064k70been-vishay+dale-42814270; OctopartID: af7c64fbc12470bb; Resistance Tolerance: ±0.1%; RoHS: Compliant
R20 = CMP-4023469-2: PANASONIC   ERA8AEB473V   RESISTOR, 1206, 0.1%, 0.25W, 47K; Resistance: 47000.0 Ω; Voltage Rating (DC): 300.0 V; Manufacturer Part Number: ERA8AEB473V; Lifecycle Status: Not Listed by Manufacturer; Mounting Style: Surface Mount; Number of Pins: 2; Octopart Url: https://octopart.com/era8aeb473v-panasonic-10566263; OctopartID: 1aa9d30205b8c56e; Packaging: Cut Tape (CT); Power Rating: 0.25 W; REACH SVHC Compliance: No SVHC; Resistance Tolerance: ±0.1%; RoHS: Compliant
R22-R25 = CMP-3721174-2: Thin Film Resistors - SMD 1206 49.9ohm 25ppm 0.1% Tol; Manufacturer Part Number: ERA8AEB49R9V; Power Rating: 0.25 W; Resistance: 49.9 Ω; Voltage Rating (DC): 150.0 V; Lifecycle Status: Not Listed by Manufacturer; Mounting Style: Surface Mount; Octopart Url: https://octopart.com/era-8aeb49r9v-panasonic-22534637; OctopartID: 00b5c8e8fc3edf72; Packaging: Cut Tape (CT); REACH SVHC Compliance: No SVHC; Resistance Tolerance: ±0.1%; RoHS: Compliant
R26 R27 = CMP-4849877-2: PANASONIC   ERA8AEB102V; Power Rating: 0.25 W; Resistance: 1000.0 Ω; Resistance Tolerance: ±0.1%; Voltage Rating (DC): 150.0 V; Manufacturer Part Number: ERA8AEB102V; Lifecycle Status: Not Listed by Manufacturer; Mounting Style: Surface Mount; Number of Pins: 2; Octopart Url: https://octopart.com/era8aeb102v-panasonic-10566253; OctopartID: e6752fdef97e39b2; Packaging: Cut Tape (CT); REACH SVHC Compliance: No SVHC; RoHS: Compliant
U1 = CMP-7hfih1o77usjfiwb5d4g-5
U2 = CMP-10766565-2: 4Kbit, 400kHz, 2.5V, I2C Serial EEPROM, 8-Pin SOIC 150mil, Commercial Temperature; Access Time: 0.4 s; Clock Speed: 2000000.0 Hz; Frequency: 400000.0 Hz; Lead-Free Status: Lead Free; Memory Size: 500 B; Supply Voltage (DC): 5.0 V; Case/Package: SOIC; Lifecycle Status: Active; Mounting Style: Surface Mount; Number of Pins: 8; Octopart Url: https://octopart.com/24lc04b%2Fsn-microchip-104558; OctopartID: 66ccafc7dbc4b90b; Operating Voltage: 2.5 V; Packaging: Tube; REACH SVHC Compliance: No SVHC; RoHS: Compliant; Manufacturer Part Number: 24LC04B/SN
U3 = CMP-3342fa36a86cec85-5: IC Mpu EP7 74MHZ 204TFBGA
U4 = CMP-9f2a52c1ee8f40ed-1: LDL1117 Series 1.2 A 3.3 V High PSRR LDO Linear Voltage Regulator-SOT-223; Operating Temperature: -40.0 °C (min); Lifecycle Status: Not Listed by Manufacturer
X1 = CMP-779438-6: Crystal 16MHz ??30ppm (Tol) ??50ppm (Stability) 18pF FUND 40Ohm 2-Pin HC-49/US SMD T/R; RoHS: Compliant; Octopart URL: https://octopart.com/abls-16.000mhz-b4-t-abracon-18618625